# EAGLE design 18650_1S3P (EAGLE 9.6.2)
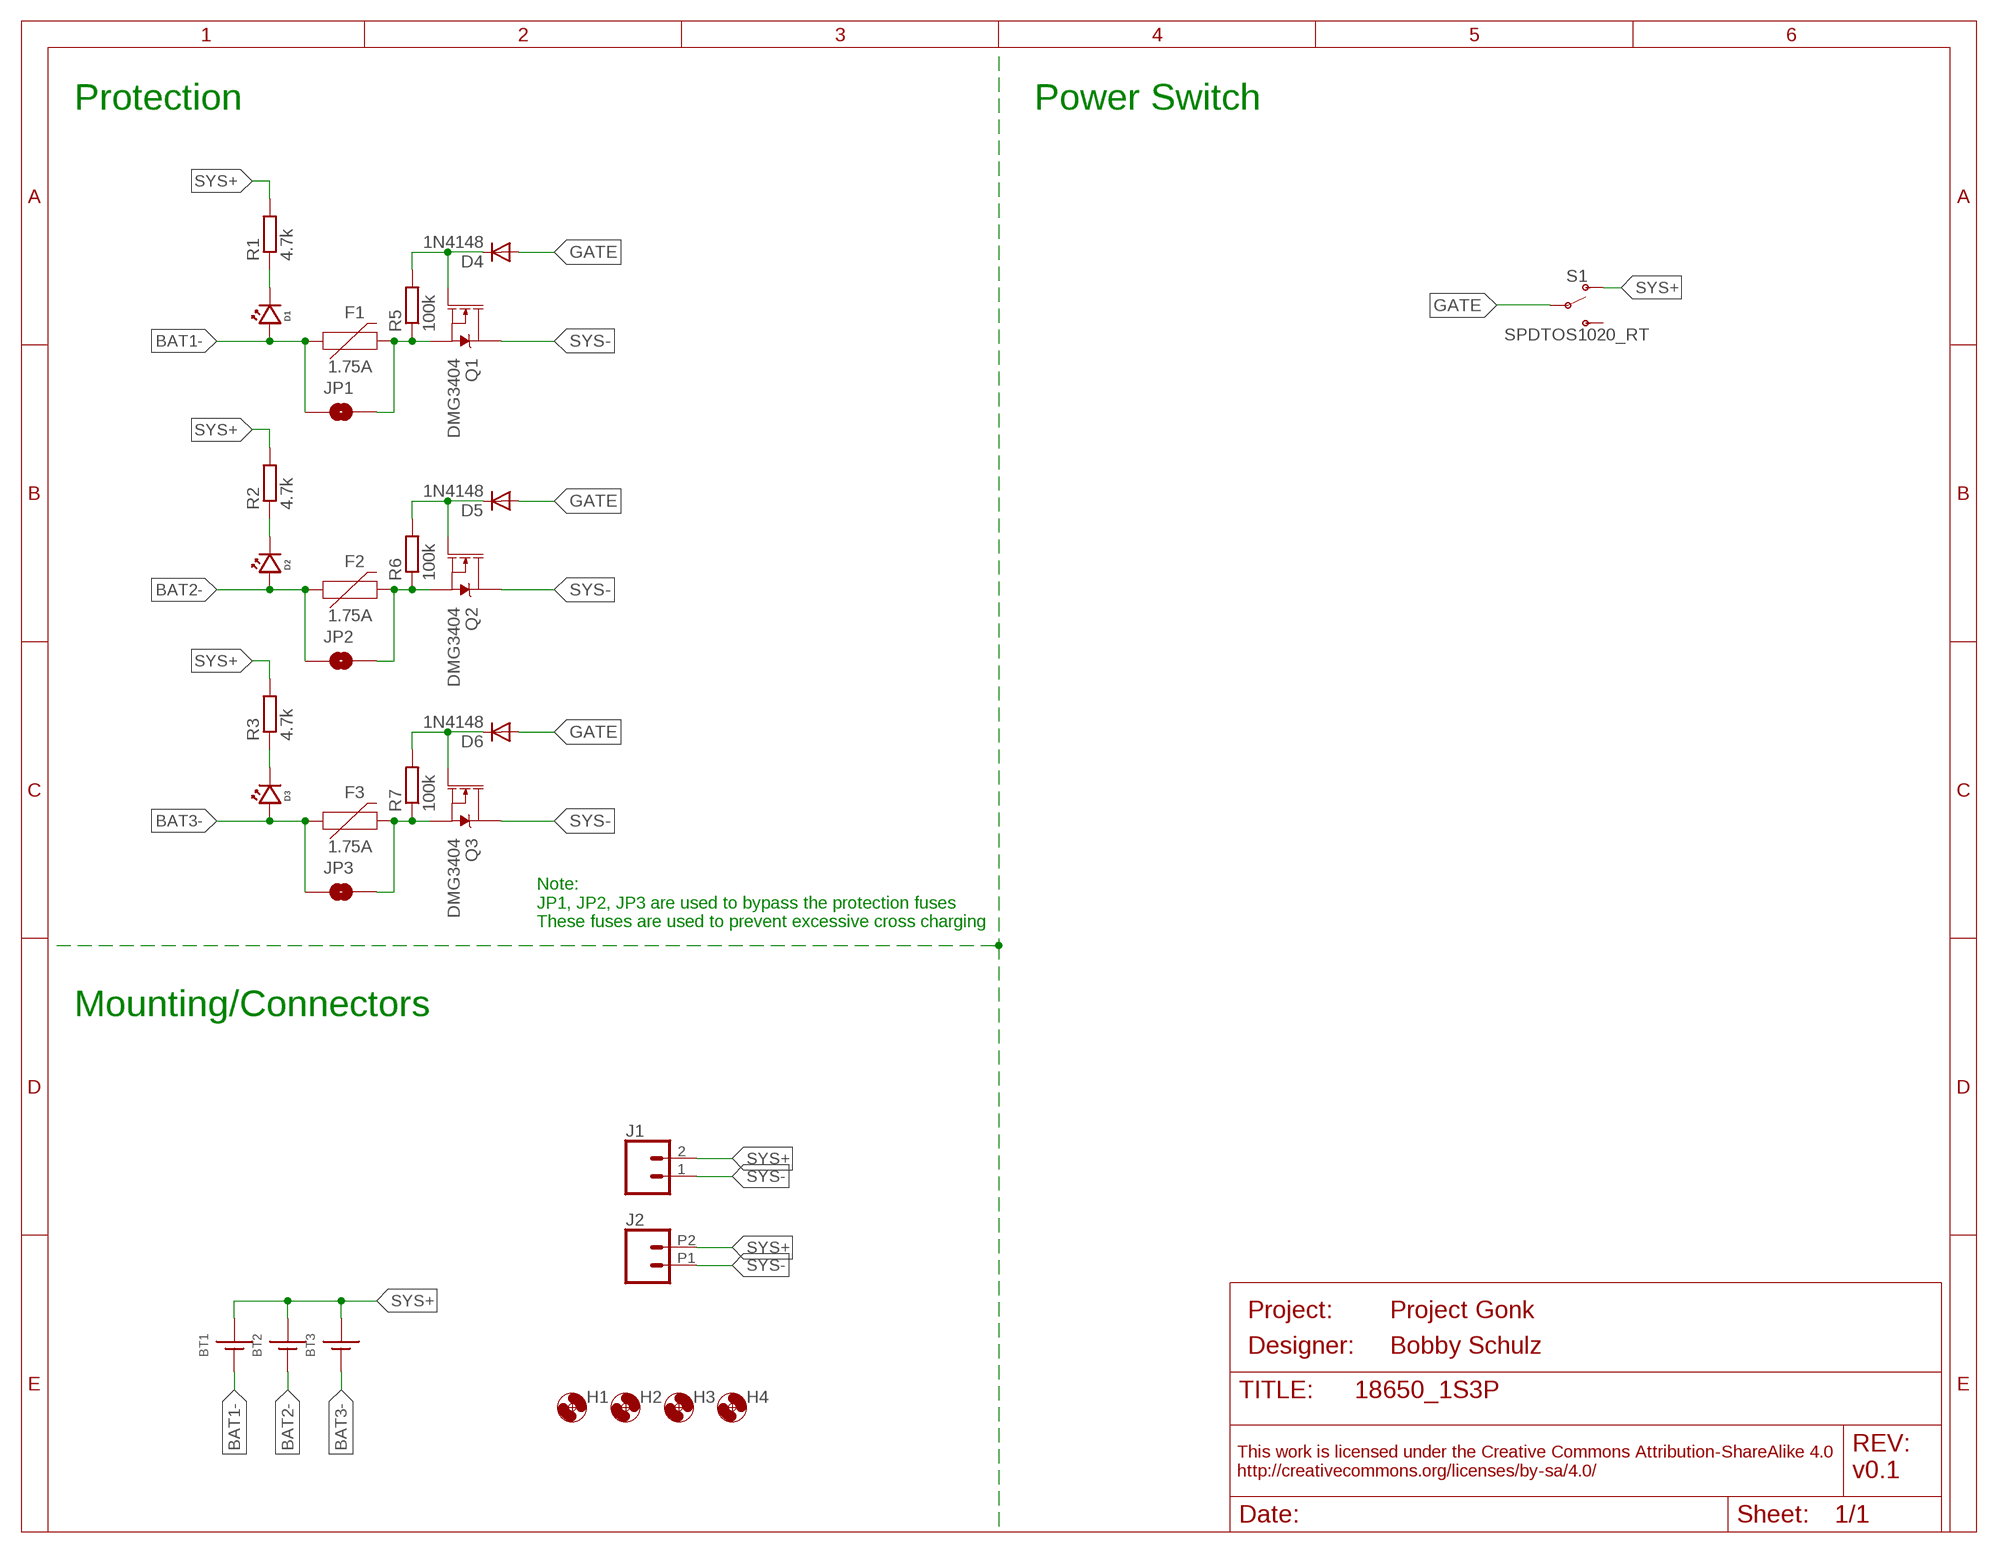
[diagram p0: schematic, sheet 1]
FRAME1 (FRAME_A_L): DESIGNER: Bobby Schulz; PROJECT: Project Gonk; REV: v0.1

## Parts
BT1  18650NO_PROTEC  [BATT_18650_CLIP]
BT2  18650NO_PROTEC  [BATT_18650_CLIP]
BT3  18650NO_PROTEC  [BATT_18650_CLIP]
D1  LED0805  [LED_0805]
D2  LED0805  [LED_0805]
D3  LED0805  [LED_0805]
D4  1N4148  DIODESOD-323  [SOD323-R]
D5  1N4148  DIODESOD-323  [SOD323-R]
D6  1N4148  DIODESOD-323  [SOD323-R]
F1  1.75A  PPTC1.75A1210  [1210_BOURNS]
F2  1.75A  PPTC1.75A1210  [1210_BOURNS]
F3  1.75A  PPTC1.75A1210  [1210_BOURNS]
H1  MOUNTING_HOLE4_NP  [4_40]
H2  MOUNTING_HOLE4_NP  [4_40]
H3  MOUNTING_HOLE4_NP  [4_40]
H4  MOUNTING_HOLE4_NP  [4_40]
J1  CONN_023.5MM_ROUND_RESTRICT  [SCREWTERMINAL-3.5MM-2_ROUND_RESTRICT]
J2  CONN_022.54_SCREW_ROUND  [1X02_2.54_SCREWTERM_ROUND]
JP1  JUMPER-SMT_2_NO_SILK  [SMT-JUMPER_2_NO_SILK]
JP2  JUMPER-SMT_2_NO_SILK  [SMT-JUMPER_2_NO_SILK]
JP3  JUMPER-SMT_2_NO_SILK  [SMT-JUMPER_2_NO_SILK]
Q1  DMG3404  MOSFET-NCH-DMG3404L  [SOT23-3]
Q2  DMG3404  MOSFET-NCH-DMG3404L  [SOT23-3]
Q3  DMG3404  MOSFET-NCH-DMG3404L  [SOT23-3]
R1  4.7k  R-EU_4.7KR0603  [R0603]
R2  4.7k  R-EU_4.7KR0603  [R0603]
R3  4.7k  R-EU_4.7KR0603  [R0603]
R5  100k  R-EU_100KR0603  [R0603]
R6  100k  R-EU_100KR0603  [R0603]
R7  100k  R-EU_100KR0603  [R0603]
S1  SPDTOS1020_RT  [OS102011MA1QN1]

## Nets
BAT1-: BT1.BATT-@1(-) BT1.BATT-@2(-) BT1.BATT-@3(-) D1.ANODE F1.1 JP1.1
BAT2-: BT2.BATT-@1(-) BT2.BATT-@2(-) BT2.BATT-@3(-) D2.ANODE F2.1 JP2.1
BAT3-: BT3.BATT-@1(-) BT3.BATT-@2(-) BT3.BATT-@3(-) D3.ANODE F3.1 JP3.1
GATE: D4.A D5.A D6.A S1.2(P)
N$1: D2.CATHODE R2.1
N$2: D1.CATHODE R1.1
N$3: F1.2 JP1.2 Q1.2(S) R5.1
N$4: F2.2 JP2.2 Q2.2(S) R6.1
N$5: D3.CATHODE R3.1
N$6: F3.2 JP3.2 Q3.2(S) R7.1
N$9: D5.C Q2.1(G) R6.2
N$10: D4.C Q1.1(G) R5.2
N$11: D6.C Q3.1(G) R7.2
SYS+: BT1.BATT+@1(+) BT1.BATT+@2(+) BT1.BATT+@3(+) BT2.BATT+@1(+) BT2.BATT+@2(+) BT2.BATT+@3(+) BT3.BATT+@1(+) BT3.BATT+@2(+) BT3.BATT+@3(+) J1.2 J2.P2 R1.2 R2.2 R3.2 S1.1(O)
SYS-: J1.1 J2.P1 Q1.3(D) Q2.3(D) Q3.3(D)
Unconnected: S1.3(S)

## Notes on the sheet
- Protection | Power Switch
- Note:
  JP1, JP2, JP3 are used to bypass the protection fuses
  These fuses are used to prevent excessive cross charging
- Mounting/Connectors

## Library data of the parts
BT1-BT3 = bschulz:18650: Battery Holder 18650 form factor Variant for with or without circuit protection (length varries depending on this); DIGIKEY: 36-54-ND; MF: Keystone; MPN: 54
D1-D3 = bschulz:LED: Genaric LED; DIGIKEY: 475-1278-1-ND; MF: OSRAM; MPN: LS R976-NR-1
D4-D6 = bschulz:DIODE: Genaric Diode; DIGIKEY: 1N4148WS-FDICT-ND; MF: Diodes Inc; MPN: 1N4148WS-7-F
F1-F3 = bschulz:PPTC: Bel Fuse PPTC; DIGIKEY: MF-USMF175X-2CT-ND; MF: Bourns; MPN: MF-USMF175X-2
H1-H4 = bschulz:MOUNTING_HOLE: Genaric Mechanical Mounting Hole Hole diameter based on max body diameter + 15% Keepout ring is for diameter of socket cap screw (minimum required clearance) TPlace ring is for diameter of pan head screw (recomended clearance) Specifications: Socket Cap <http://fastener-express.com/fastener-technical/SocketscapSS-Alloy.pdf> Button Head Socket Cap <http://fastener-express.com/fastener-technical/Button-Socket-alloy.pdf> Pan Head <http://fastener-express.com/fastener-technical/pan-machine-Screws.pdf>
J1 = bschulz:CONN_02: Genaric 2 terminal header SCREW_2.54 <https://www.digikey.com/product-detail/en/on-shore-technology-inc/OSTVN02A150/ED10561-ND/1588862> 39532_RA <https://www.digikey.com/product-detail/en/molex/0395321002/WM7845-ND/1280696>; DIGIKEY: ED2635-ND; MF: On Shore; MPN: OSTTE020161
J2 = bschulz:CONN_02: Genaric 2 terminal header SCREW_2.54 <https://www.digikey.com/product-detail/en/on-shore-technology-inc/OSTVN02A150/ED10561-ND/1588862> 39532_RA <https://www.digikey.com/product-detail/en/molex/0395321002/WM7845-ND/1280696>; DIGIKEY: ED10561-ND; MF: OnShore; MPN: OSTVN02A150
JP1-JP3 = SparkFun-Jumpers:JUMPER-SMT_2_NO: Normally open jumper This jumper has two pads in close proximity to each other. Apply solder to close the connection. Round pads are easier to solder for beginners, but are a lot larger. SparkFun Product that uses the round pads: SparkFun EL Sequencer <https://www.sparkfun.com/products/12781>
Q1-Q3 = bschulz:MOSFET-NCH: N-channel MOSFETs Voltage controlled devices that allow control of high current outputs. SparkFun Products: SparkFun OpenScale <https://www.sparkfun.com/products/13261> SparkFun Digital Sandbox <https://www.sparkfun.com/products/12651> SparkFun Monster Moto Shield <https://www.sparkfun.com/products/10182> SparkFun MOSFET Power Controller <https://www.sparkfun.com/products/11214>; DIGIKEY: DMG3404L-7DICT-ND; MF: Diodes Incorporated; MPN: DMG3404L-7
R1-R3 = bschulz_passives:R-EU_: RESISTOR, European symbol Digikey Parts: Yageo, 0402 <https://www.digikey.com/products/en/resistors/chip-resistor-surface-mount/52?k=&pkeyword=&sv=0&s=4356&sf=1&FV=-1%7C13%2C7%7C2%2C1291%7C39157%2C1989%7C0%2C-8%7C52%2C3%7C1131%2C3%7C2503&quantity=&ColumnSort=0&page=1&stock=1&pageSize=25> Yageo, 0603 <https://www.digikey.com/products/en/resistors/chip-resistor-surface-mount/52?k=&pkeyword=&sv=0&pv1291=39245&sf=1&FV=-5%7C4356%2C-5%7C47360%2C-8%7C52%2C-1%7C13%2C7%7C2%2C1989%7C0&quantity=10&ColumnSort=1000011&page=1&stock=1&pageSize=25> Panasonic, 0603 <https://www.digikey.com/products/en/resistors/chip-resistor-surface-mount/52?k=&pkeyword=&pv252=68&sf=0&FV=ffec373d%2C1c0002%2C142c040c%2C1f140000%2Cffe00034%2C80002%2Cc0001&quantity=&ColumnSort=0&page=1&stock=1&pageSize=25> Panasonic, precision, 0603 <https://www.digikey.com/products/en/resistors/chip-resistor-surface-mount/52?FV=ffec4907%2Cfffc000a%2Cc0172%2C142c040c%2C1f140000%2Cffe00034%2C1c0002&quantity=100&ColumnSort=2085&page=1&stock=1&pageSize=25> Panasonic, 0805 <https://www.digikey.com/products/en/resistors/chip-resistor-surface-mount/52?k=&pkeyword=&pv3=1&sf=0&FV=ffec373d%2C1c0002%2C1f140000%2Cffe00034%2C142c040d&quantity=&ColumnSort=0&page=1&stock=1&pageSize=25> Rohm, current sense <https://www.digikey.com/products/en/resistors/chip-resistor-surface-mount/52?k=&pkeyword=&pv3=1&sf=0&FV=ffecb688%2C1f140000%2Cffe00034%2C1c0002&quantity=&ColumnSort=0&page=1&stock=1&pageSize=25> Vishay, pulse proof automotive <https://www.digikey.com/products/en/resistors/chip-resistor-surface-mount/52?k=&pkeyword=&pv7=2&sf=0&FV=ffec5d6b%2Cffe00034%2C1f140000&quantity=&ColumnSort=0&page=1&stock=1&pageSize=25>; DIGIKEY: 311-4.70KHRCT-ND; MF: Yageo; MPN: RC0603FR-074K7L; VALUE_PART: 4.7k
R5-R7 = bschulz_passives:R-EU_: RESISTOR, European symbol Digikey Parts: Yageo, 0402 <https://www.digikey.com/products/en/resistors/chip-resistor-surface-mount/52?k=&pkeyword=&sv=0&s=4356&sf=1&FV=-1%7C13%2C7%7C2%2C1291%7C39157%2C1989%7C0%2C-8%7C52%2C3%7C1131%2C3%7C2503&quantity=&ColumnSort=0&page=1&stock=1&pageSize=25> Yageo, 0603 <https://www.digikey.com/products/en/resistors/chip-resistor-surface-mount/52?k=&pkeyword=&sv=0&pv1291=39245&sf=1&FV=-5%7C4356%2C-5%7C47360%2C-8%7C52%2C-1%7C13%2C7%7C2%2C1989%7C0&quantity=10&ColumnSort=1000011&page=1&stock=1&pageSize=25> Panasonic, 0603 <https://www.digikey.com/products/en/resistors/chip-resistor-surface-mount/52?k=&pkeyword=&pv252=68&sf=0&FV=ffec373d%2C1c0002%2C142c040c%2C1f140000%2Cffe00034%2C80002%2Cc0001&quantity=&ColumnSort=0&page=1&stock=1&pageSize=25> Panasonic, precision, 0603 <https://www.digikey.com/products/en/resistors/chip-resistor-surface-mount/52?FV=ffec4907%2Cfffc000a%2Cc0172%2C142c040c%2C1f140000%2Cffe00034%2C1c0002&quantity=100&ColumnSort=2085&page=1&stock=1&pageSize=25> Panasonic, 0805 <https://www.digikey.com/products/en/resistors/chip-resistor-surface-mount/52?k=&pkeyword=&pv3=1&sf=0&FV=ffec373d%2C1c0002%2C1f140000%2Cffe00034%2C142c040d&quantity=&ColumnSort=0&page=1&stock=1&pageSize=25> Rohm, current sense <https://www.digikey.com/products/en/resistors/chip-resistor-surface-mount/52?k=&pkeyword=&pv3=1&sf=0&FV=ffecb688%2C1f140000%2Cffe00034%2C1c0002&quantity=&ColumnSort=0&page=1&stock=1&pageSize=25> Vishay, pulse proof automotive <https://www.digikey.com/products/en/resistors/chip-resistor-surface-mount/52?k=&pkeyword=&pv7=2&sf=0&FV=ffec5d6b%2Cffe00034%2C1f140000&quantity=&ColumnSort=0&page=1&stock=1&pageSize=25>; DIGIKEY: 311-100KHRCT-ND; MF: Yageo; MPN: RC0603FR-07100KL; VALUE_PART: 100k
S1 = bschulz:SPDT: Genaric SPDT switch; DIGIKEY: CKN9559-ND; MF: C&K; MPN: OS102011MA1QN1

## Board
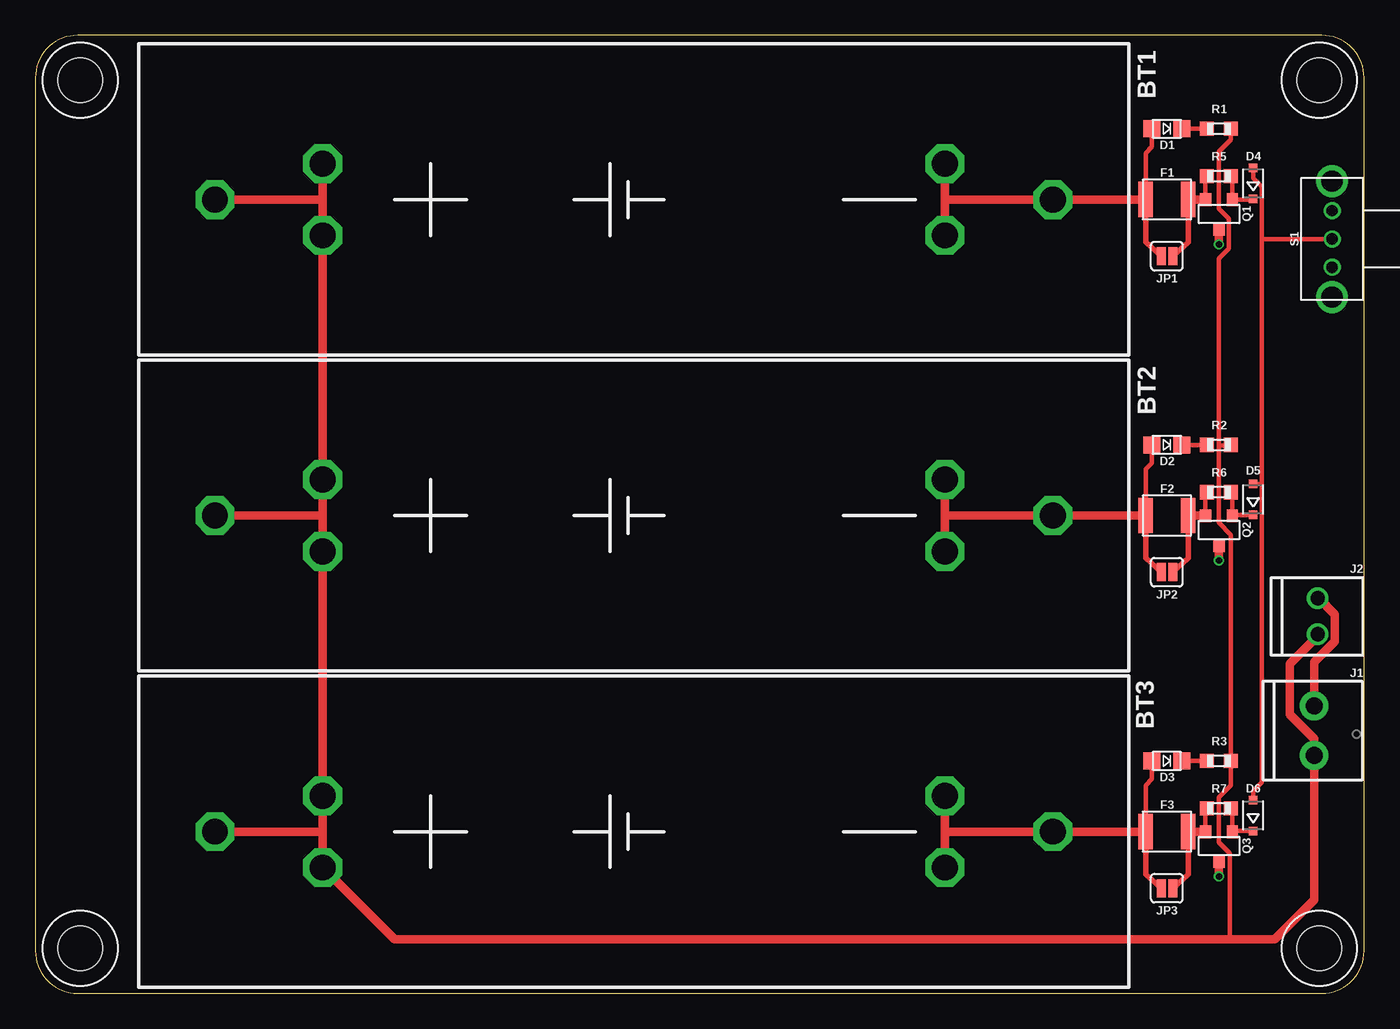
[diagram p1: board, top side]
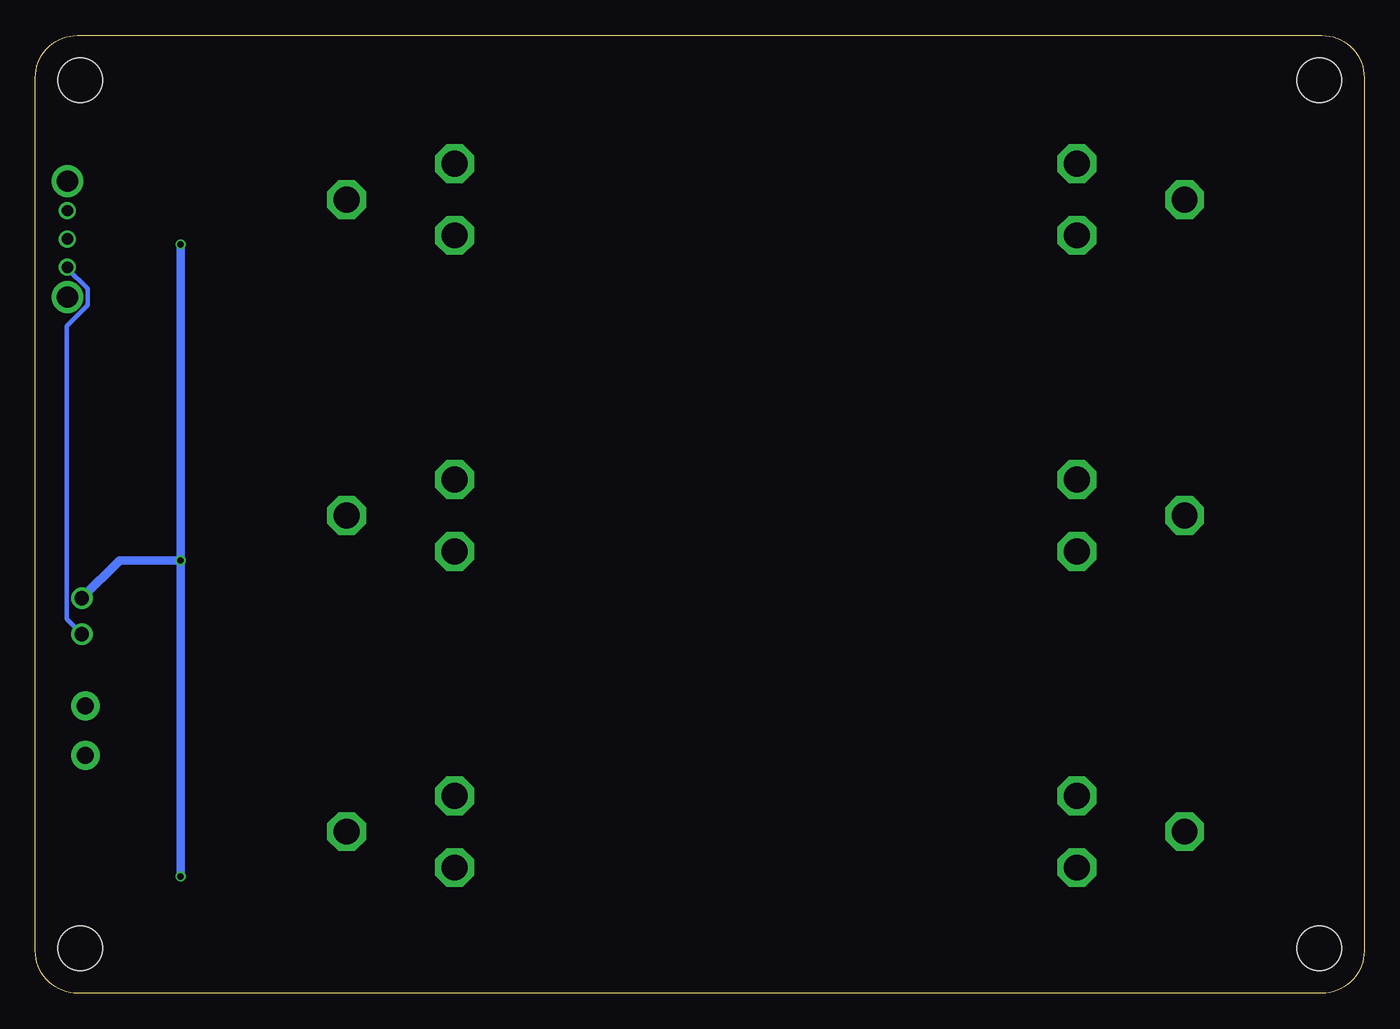
[diagram p2: board, bottom side, seen from below]

Size 93.96 x 67.74 mm. Coordinates in mm from the lower left corner, seen from the top.
Outline: 0,64.74 0,3 arc90 3,0 90.96,0 arc90 93.96,3 93.96,64.74 arc90 90.96,67.74 3,67.74 arc90 0,64.74
Copper layers (1*16): Top 0.035559375mm / dielectric 1.6mm / Bottom 0.035559375mm
Design rules "oshpark-2layer": minimum track width 6mil, minimum drill 10mil, track to track 6mil, track to pad 6mil, pad to pad 6mil, via to via 6mil, smd to smd 6mil, copper to edge 15mil, drill to drill 6mil, minimum pad ring 5mil, minimum via ring 5mil, stop-mask expansion 2.5mil, vias tented up to drill 0mil, thermal gap 10mil

### Footprints (pad centres in the part's own frame; a part is rotated, then mirrored left to right if it is on the bottom)
BATT_18650_CLIP = drill 1.83 octagon: BATT+@1 0,0; BATT+@2 7.62,2.54; BATT+@3 7.62,-2.54; BATT-@1 59.246,0; BATT-@2 51.626,2.54; BATT-@3 51.626,-2.54
LED_0805 = smd 1.2 x 1.2: ANODE 1.05,0; CATHODE -1.05,0
SOD323-R = smd 0.6 x 0.6: A 1.1,0; C -1.1,0
1210_BOURNS = smd 1 x 2.5: 1 -1.5,0; 2 1.5,0
4_40 = hole 3.175: 0,0
SCREWTERMINAL-3.5MM-2_ROUND_RESTRICT = drill 1.2 pad 2.032: 1 0,0; 2 3.5,0
1X02_2.54_SCREWTERM_ROUND = drill 1.016: P1 1.27,0; P2 -1.27,0
SMT-JUMPER_2_NO_SILK = smd 0.635 x 1.27: 1 -0.406,0; 2 0.406,0
SOT23-3 = smd 0.8 x 0.9: 1 -0.95,-1; 2 0.95,-1; 3 0,1.1
R0603 = smd 1 x 1: 1 -0.85,0; 2 0.85,0
OS102011MA1QN1 = drill 0.8: 1 -2,0; 2 0,0; 3 2,0 | drill 1.5: BODY@1 -4.1,0; BODY@2 4.1,0

### Placement (x,y rotation side)
BT1  12.7,56.13 0 top
BT2  12.7,33.78 0 top
BT3  12.7,11.43 0 top
D1  80.01,61.13 180 top
D2  80.01,38.78 180 top
D3  80.01,16.43 180 top
D4  86.11,57.28 90 top
D5  86.11,34.92 90 top
D6  86.11,12.57 90 top
F1  80.01,56.13 0 top
F2  80.01,33.78 0 top
F3  80.01,11.43 0 top
H1  3.17,3.17 0 top
H2  3.17,64.57 0 top
H3  90.78,3.17 0 top
H4  90.78,64.57 0 top
J1  90.42,20.32 270 top
J2  90.68,26.67 90 top
JP1  80.01,52.13 0 top
JP2  80.01,29.78 0 top
JP3  80.01,7.43 0 top
Q1  83.69,55.12 180 top
Q2  83.69,32.77 180 top
Q3  83.69,10.41 180 top
R1  83.69,61.13 0 top
R2  83.69,38.78 0 top
R3  83.69,16.43 0 top
R5  83.69,57.78 0 top
R6  83.69,35.43 0 top
R7  83.69,13.08 0 top
S1  91.69,53.34 90 top

### Tracks (layer width: path | path; a pad name or v marks a point on that pad's centre or on a via)
BAT1-
  Top 0.305: F1.1 78.51,59.41 78.96,59.86 D1.ANODE
  Top 0.406: JP1.1 78.51,53.13 F1.1
  Top 0.61: F1.1 BT1.BATT-@1 64.33,56.13 | BT1.BATT-@2 64.33,56.13 | 64.33,56.13 BT1.BATT-@3
BAT2-
  Top 0.305: F2.1 78.51,37.06 78.96,37.51 D2.ANODE
  Top 0.406: JP2.1 78.51,30.77 F2.1
  Top 0.61: F2.1 BT2.BATT-@1 64.33,33.78 | BT2.BATT-@3 64.33,33.78 | 64.33,33.78 BT2.BATT-@2
BAT3-
  Top 0.305: F3.1 78.51,11.68 78.51,14.71 78.96,15.16 D3.ANODE
  Top 0.406: JP3.1 78.51,8.42 78.51,11.68
  Top 0.61: F3.1 BT3.BATT-@1 64.33,11.43 | BT3.BATT-@2 64.33,11.43 | 64.33,11.43 BT3.BATT-@3
GATE
  Top 0.305: D4.A 86.11,57.66 86.71,57.05 86.71,53.34 | 86.71,53.34 86.71,36.07 | 86.71,36.07 86.71,14.91 86.11,14.31 D6.A | D5.A 86.67,36.02 86.71,36.07 | S1.2 86.71,53.34
N$1
  Top 0.305: D2.CATHODE R2.1
N$2
  Top 0.305: D1.CATHODE R1.1
N$3
  Top 0.305: R5.1 82.74,57.69 Q1.2
  Top 0.406: JP1.2 81.51,53.13 F1.2
  Top 0.61: Q1.2 81.53,56.12 F1.2
N$4
  Top 0.305: R6.1 82.74,35.33 Q2.2
  Top 0.406: JP2.2 81.51,30.77 F2.2
  Top 0.61: Q2.2 82.73,33.78 F2.2
N$5
  Top 0.305: D3.CATHODE R3.1
N$6
  Top 0.305: R7.1 82.74,12.98 Q3.2
  Top 0.406: JP3.2 81.51,8.42 F3.2
  Top 0.61: Q3.2 81.53,11.41 F3.2
N$9
  Top 0.305: R6.2 84.64,35.33 Q2.1 84.7,33.83 D5.C
N$10
  Top 0.305: R5.2 84.64,57.69 Q1.1 86.05,56.12 D4.C
N$11
  Top 0.305: D6.C 84.7,11.47 Q3.1 84.64,12.98 R7.2
SYS+
  Top 0.305: 84.69,38.93 R2.2 84.5,38.73 83.69,38.73 | 83.69,38.73 83.69,33.27 84.54,32.42 R3.2 84.54,14.69 83.69,13.84 83.69,10.67 84.45,9.91 84.45,3.81 | 83.69,38.73 83.69,51.94 84.4,52.65 84.4,54.79 83.69,55.5 83.69,59.52 84.54,60.37 R1.2
  Top 0.61: J2.P2 90.68,25.26 88.7,23.28 88.7,19.71 90.42,17.98 J1.2 90.42,6.6 87.63,3.81 84.45,3.81 25.4,3.81 BT3.BATT+@3 20.32,11.43 | BT1.BATT+@2 20.32,56.13 | 20.32,56.13 BT1.BATT+@3 BT2.BATT+@2 20.32,33.78 | BT1.BATT+@1 20.32,56.13 | 20.32,33.78 BT2.BATT+@3 BT3.BATT+@2 20.32,11.43 | BT2.BATT+@1 20.32,33.78 | BT3.BATT+@1 20.32,11.43
  Bottom 0.305: S1.1 91.69,51.26 90.26,49.83 90.26,48.65 91.74,47.17 91.74,26.47 J2.P2
SYS-  (via drill 0.45)
  Top 0.61: J1.1 90.42,23.42 91.9,24.89 91.9,26.79 90.75,27.94 J2.P1 | Q1.3 v83.69,52.96 | v83.69,30.61 Q2.3 | v83.69,8.26 Q3.3
  Bottom 0.61: v83.69,52.96 v83.69,30.61 | v83.69,30.61 v83.69,8.26 | J2.P1 88.01,30.61 v83.69,30.61

### Text on the board
tDocu: OFF | ON | - | + | - | + | Vout | 1S3P - 18650 / Project Gonk / Bobby Schulz / v0.1